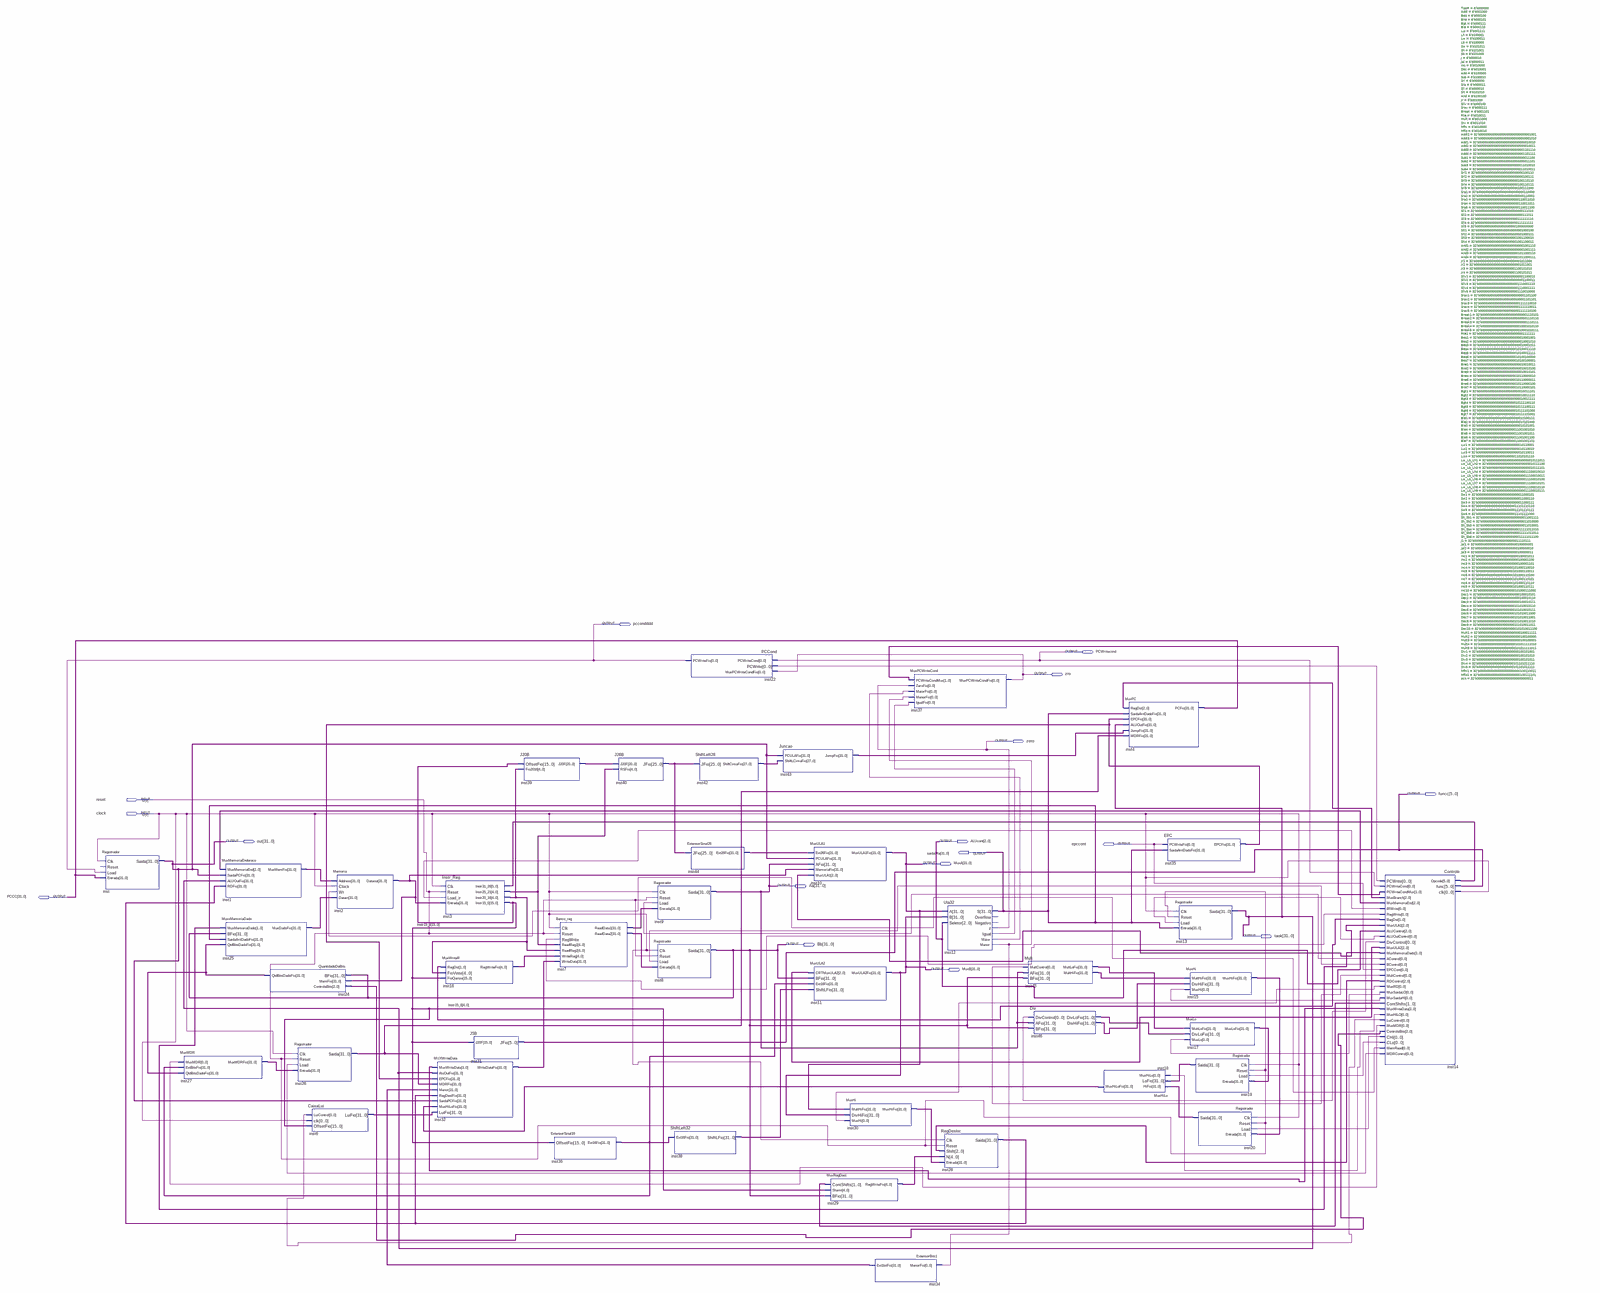
[diagram p0: schematic sheet, whole]
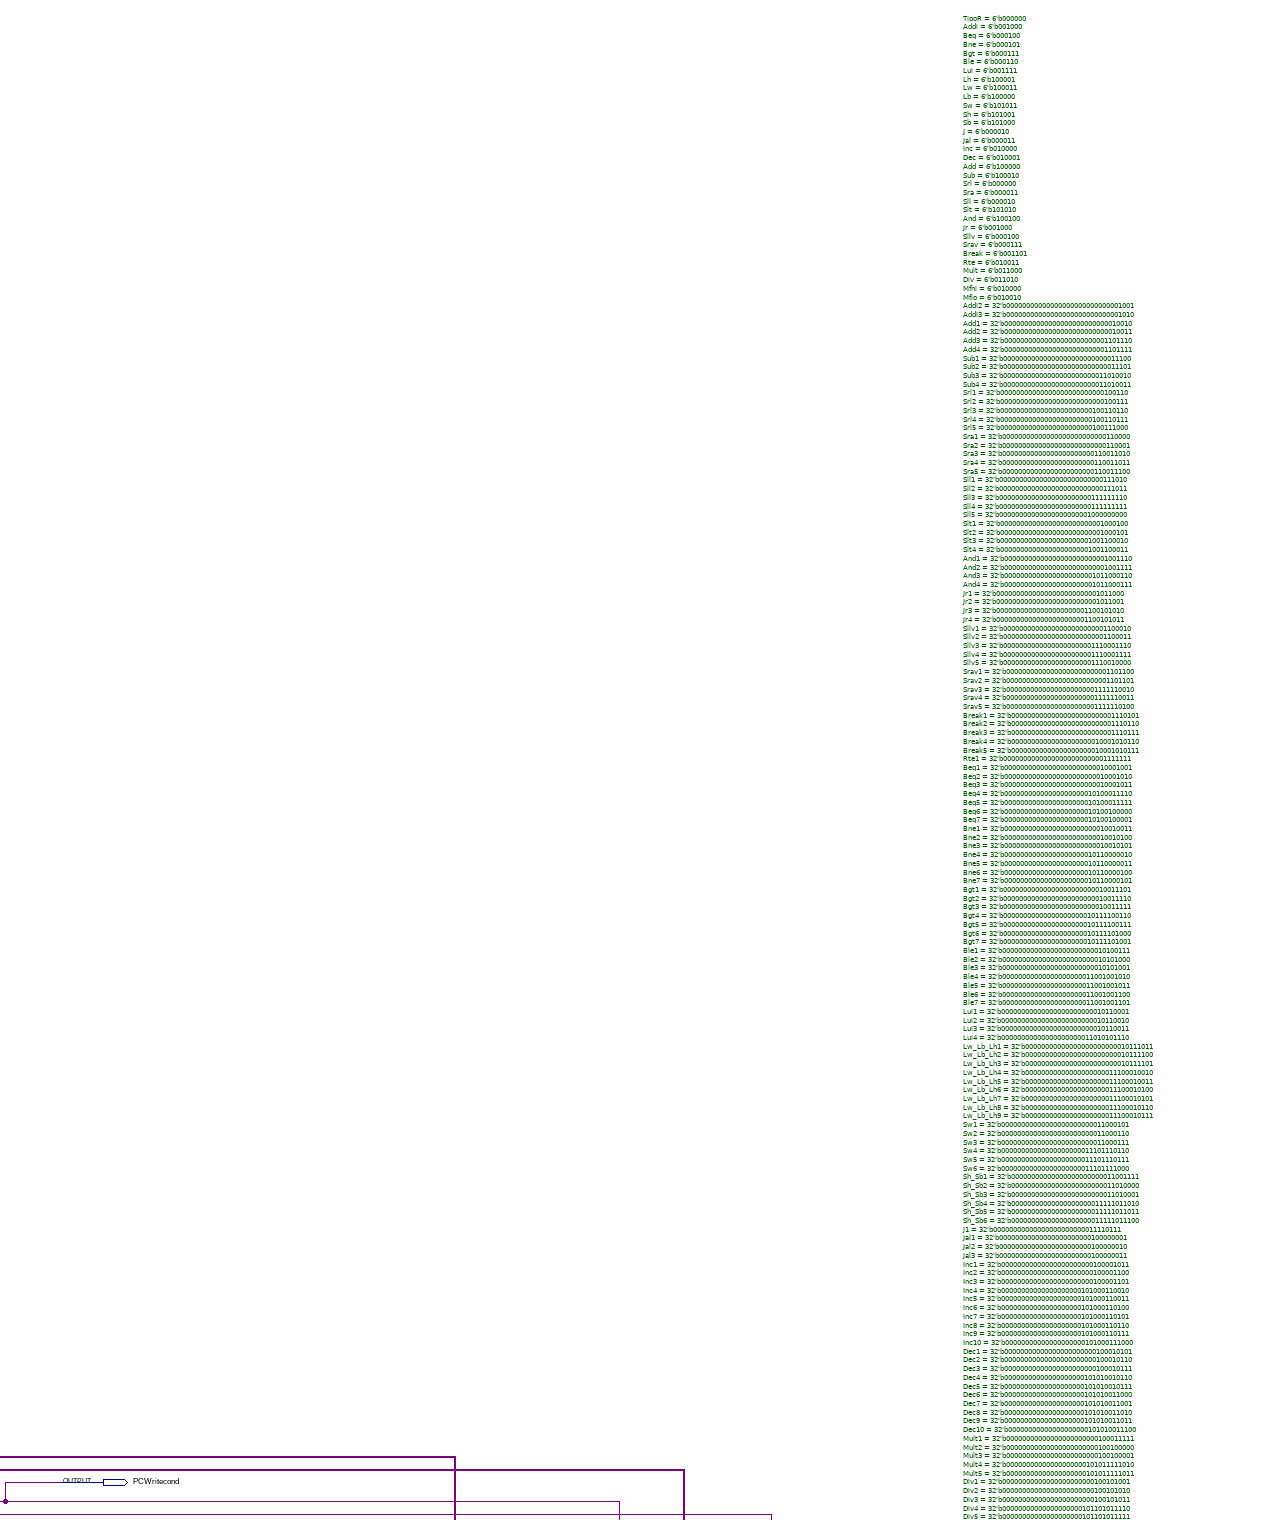
[diagram p1: schematic sheet, upper right part]
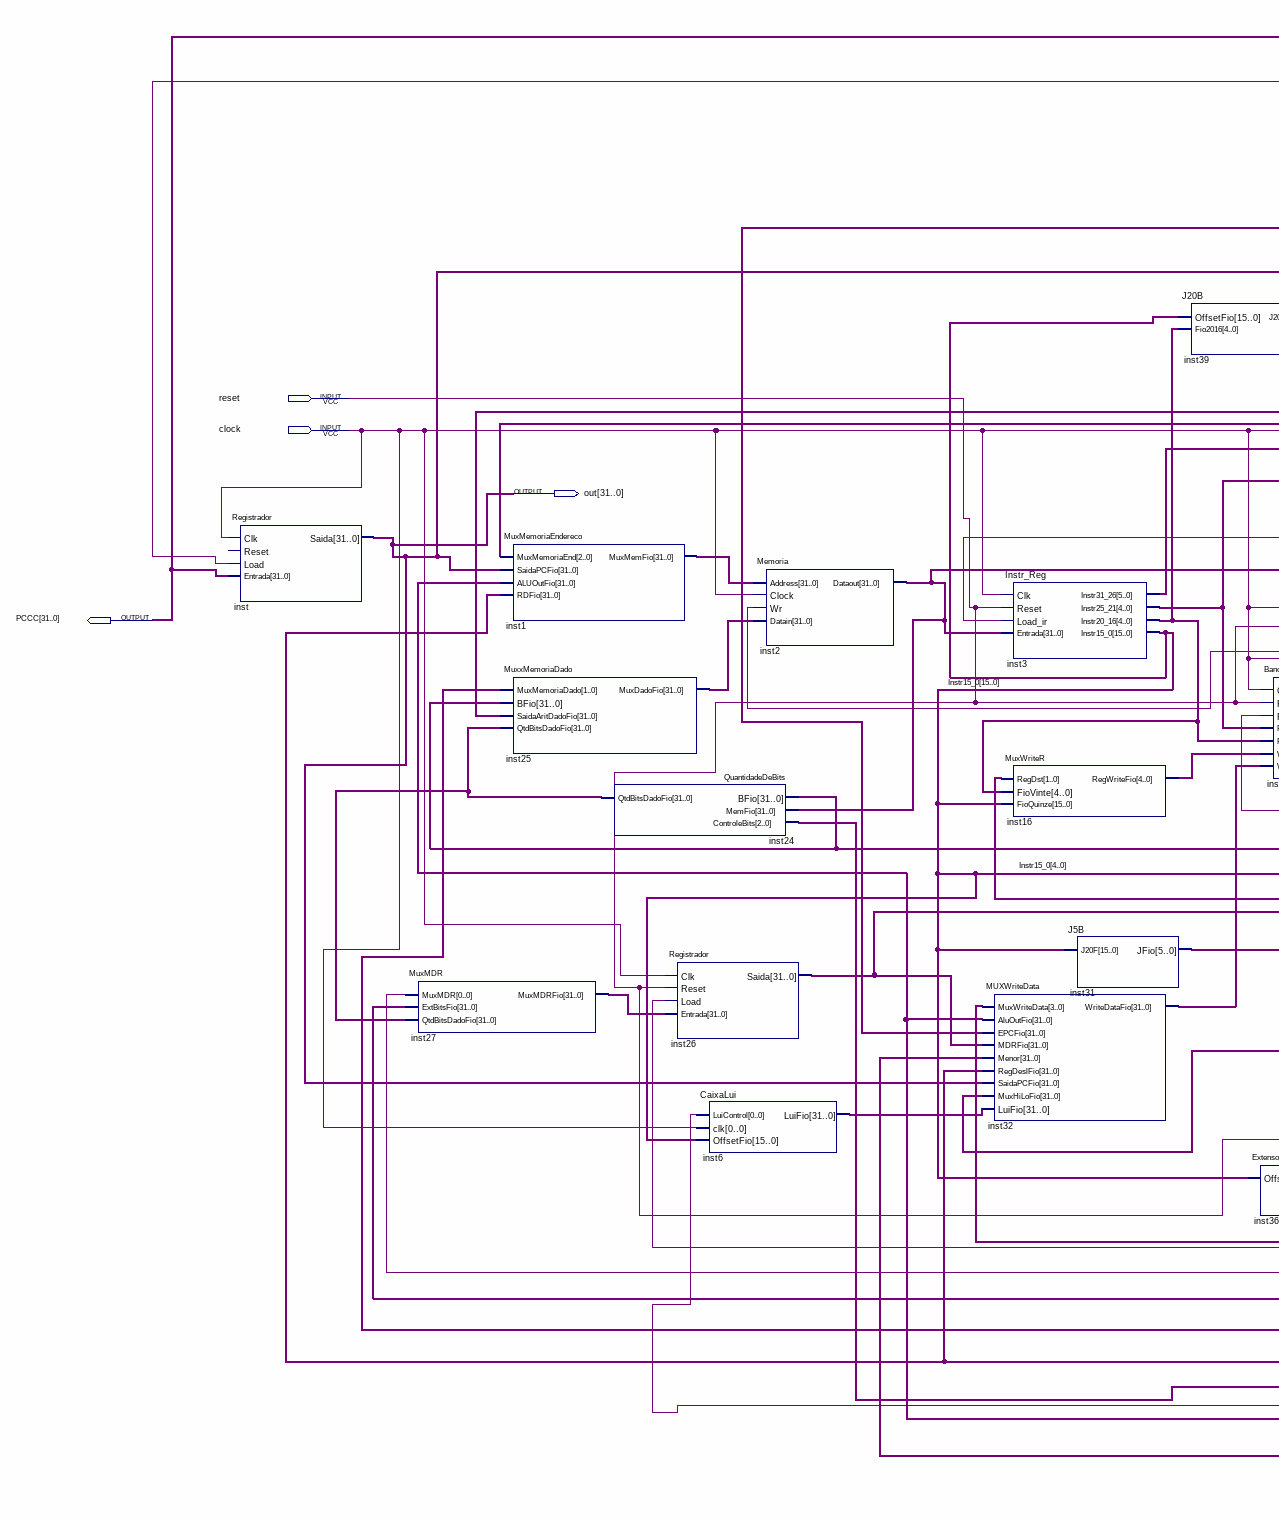
[diagram p2: schematic sheet, lower left part]
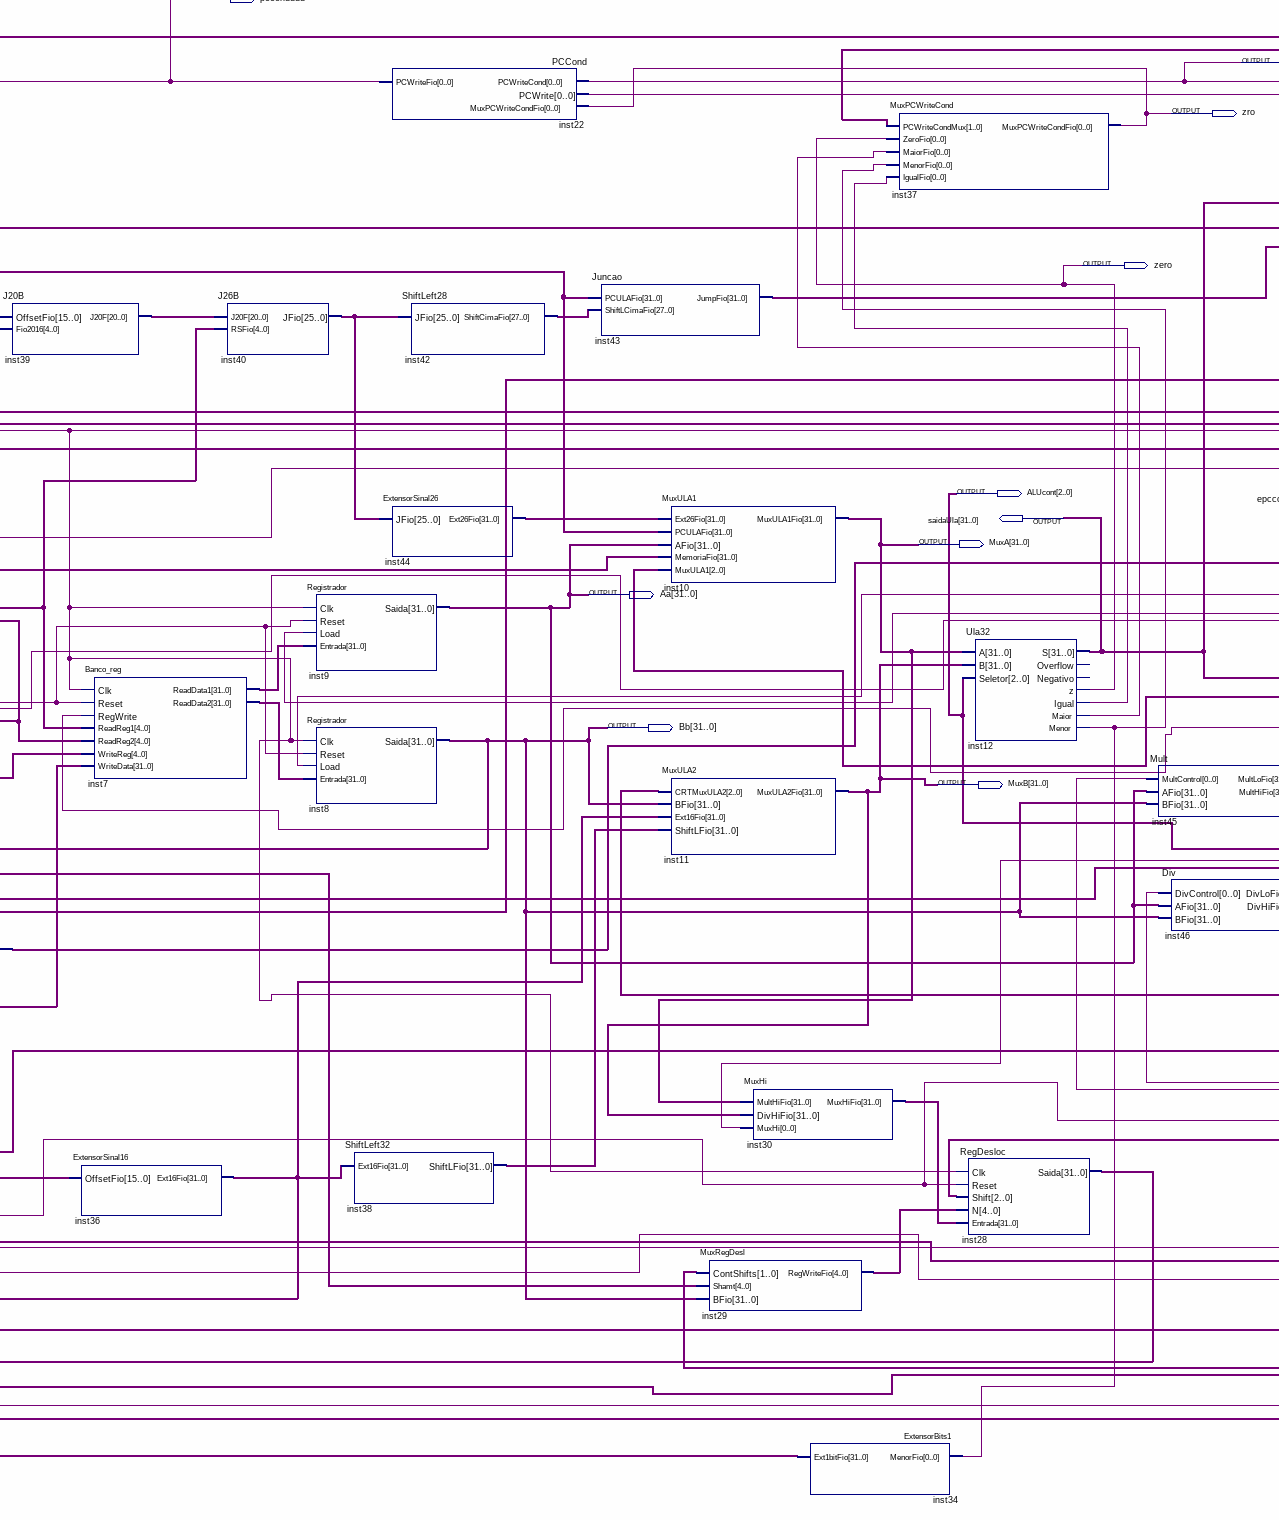
[diagram p3: schematic sheet, lower centre part]
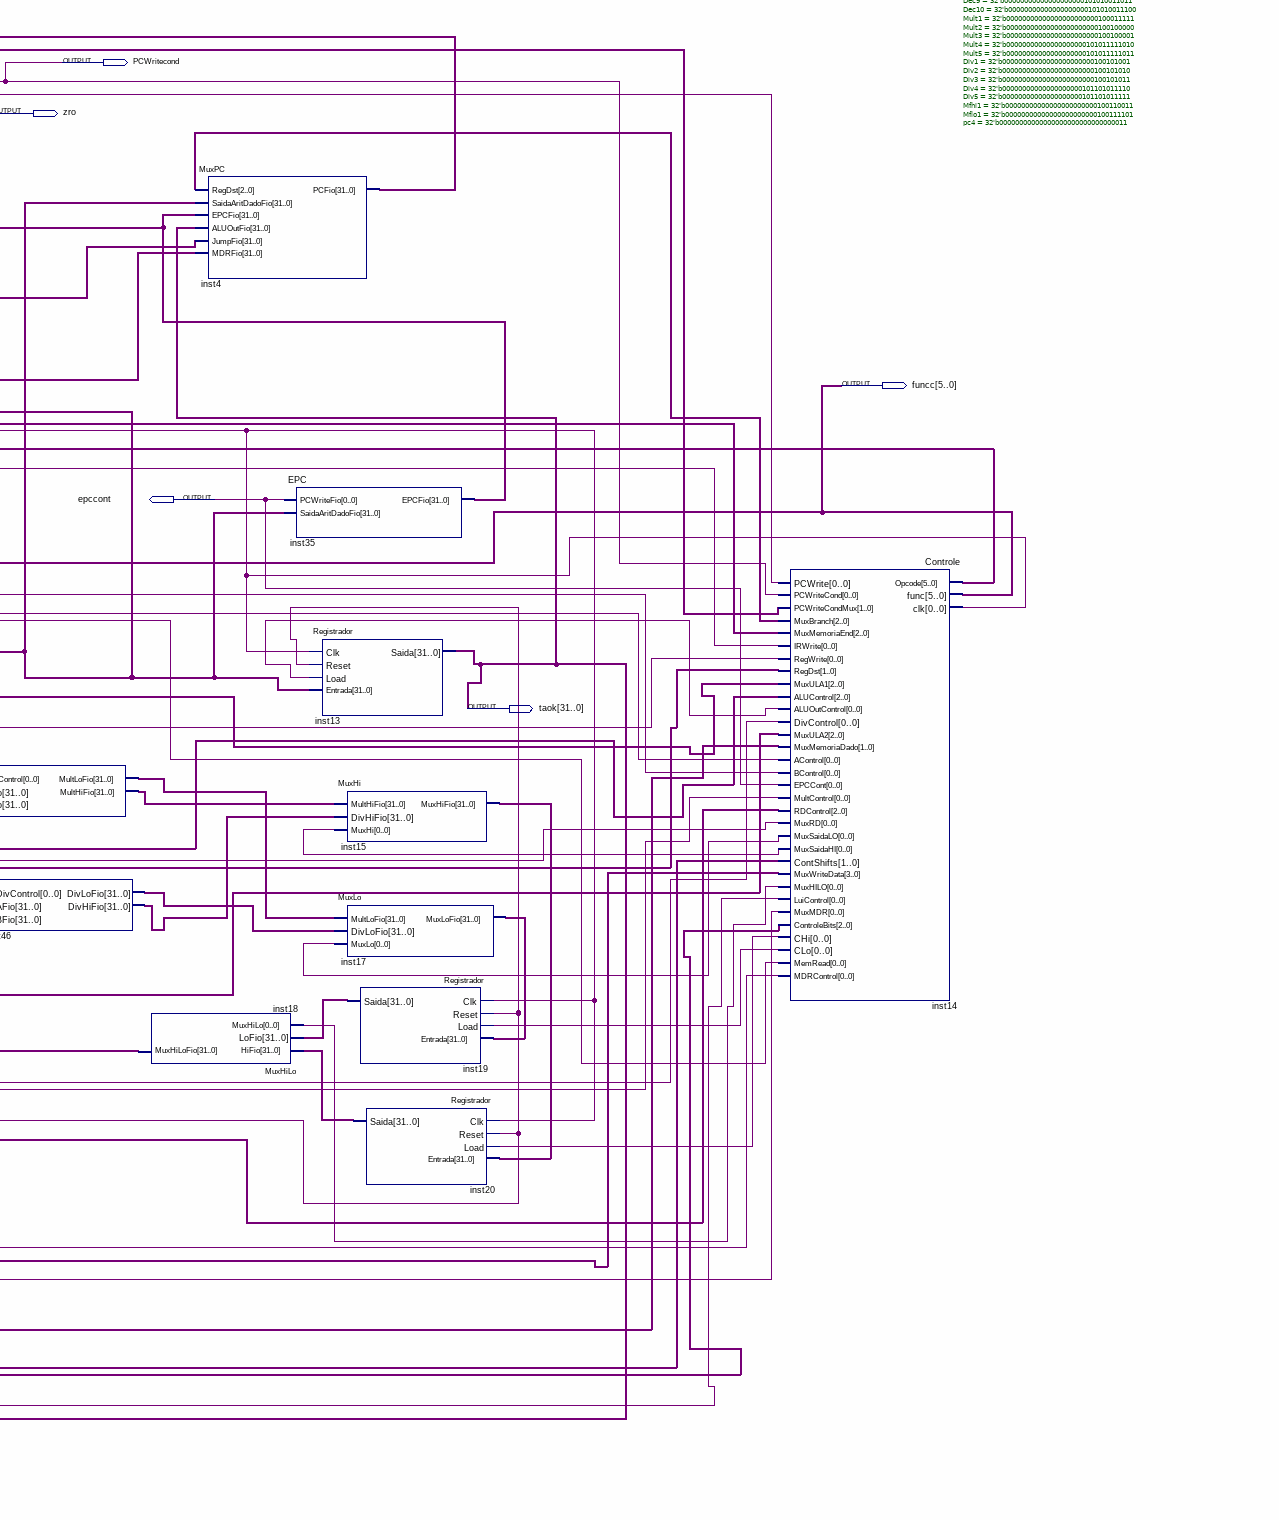
[diagram p4: schematic sheet, lower right part]
// Quartus schematic CPU.bdf as structural Verilog: 42 symbols, 17 pins
module CPU (
  input  reset,
  input  clock,
  output pccondddd,
  output PCWritecond,
  output zro,
  output zero,
  output [5:0] funcc,
  output [31:0] out,
  output [2:0] ALUcont,
  output epccont,
  output [31:0] saidaUla,
  output [31:0] MuxA,
  output [31:0] Aa,
  output [31:0] PCCC,
  output [31:0] taok,
  output [31:0] Bb,
  output [31:0] MuxB
);

  wire inst12_igual, inst12_maior, inst12_menor, inst14_acontrol, inst14_aluoutcontrol, inst14_bcontrol,
       inst14_chi, inst14_clo, inst14_divcontrol, inst14_irwrite, inst14_luicontrol, inst14_mdrcontrol,
       inst14_memread, inst14_multcontrol, inst14_muxhilo, inst14_muxmdr, inst14_muxrd, inst14_muxsaidahi,
       inst14_muxsaidalo, inst14_pcwrite, inst14_regwrite;
  wire [1:0] inst14_contshifts, inst14_muxmemoriadado, inst14_pcwritecondmux, inst14_regdst;
  wire [2:0] inst14_controlebits, inst14_muxbranch, inst14_muxmemoriaend, inst14_muxula1, inst14_muxula2,
       inst14_rdcontrol;
  wire [3:0] inst14_muxwritedata;
  wire [4:0] inst3_instr20_16, inst3_instr25_21, inst16_regwritefio, inst29_regwritefio;
  wire [5:0] inst3_instr31_26;
  wire [15:0] Instr15_0;
  wire [20:0] inst39_j20f;
  wire [25:0] inst40_jfio;
  wire [27:0] inst42_shiftcimafio;
  wire [31:0] inst1_muxmemfio, inst2_dataout, inst6_luifio, inst7_readdata1, inst7_readdata2,
       inst15_muxhifio, inst17_muxlofio, inst18_muxhilofio, inst19_saida, inst20_saida,
       inst24_qtdbitsdadofio, inst25_muxdadofio, inst26_saida, inst27_muxmdrfio, inst28_saida,
       inst30_muxhifio, inst32_writedatafio, inst34_ext1bitfio, inst35_epcfio, inst36_ext16fio,
       inst38_shiftlfio, inst43_jumpfio, inst44_ext26fio, inst45_multhifio, inst45_multlofio,
       inst46_divhifio, inst46_divlofio;

  Registrador inst (.Clk(clock), .Load(pccondddd), .Entrada(PCCC), .Saida(out));  // open: Reset
  MuxMDR inst27 (
    .MuxMDR(inst14_muxmdr), .ExtBitsFio(inst36_ext16fio), .QtdBitsDadoFio(inst24_qtdbitsdadofio),
    .MuxMDRFio(inst27_muxmdrfio));
  MuxMemoriaEndereco inst1 (
    .MuxMemoriaEnd(inst14_muxmemoriaend), .SaidaPCFio(out), .ALUOutFio(taok), .RDFio(inst28_saida),
    .MuxMemFio(inst1_muxmemfio));
  MuxxMemoriaDado inst25 (
    .MuxMemoriaDado(inst14_muxmemoriadado), .BFio(Bb), .SaidaAritDadoFio(saidaUla),
    .QtdBitsDadoFio(inst24_qtdbitsdadofio), .MuxDadoFio(inst25_muxdadofio));
  QuantidadeDeBits inst24 (
    .BFio(Bb), .MemFio(inst2_dataout), .ControleBits(inst14_controlebits),
    .QtdBitsDadoFio(inst24_qtdbitsdadofio));
  Registrador inst26 (
    .Clk(clock), .Reset(reset), .Load(inst14_mdrcontrol), .Entrada(inst27_muxmdrfio), .Saida(inst26_saida));
  CaixaLui inst6 (.LuiControl(inst14_luicontrol), .clk(clock), .OffsetFio(Instr15_0), .LuiFio(inst6_luifio));
  Memoria inst2 (
    .Address(inst1_muxmemfio), .Clock(clock), .Wr(inst14_memread), .Datain(inst25_muxdadofio),
    .Dataout(inst2_dataout));
  Instr_Reg inst3 (
    .Clk(clock), .Reset(reset), .Load_ir(inst14_irwrite), .Entrada(inst2_dataout),
    .Instr31_26(inst3_instr31_26), .Instr25_21(inst3_instr25_21), .Instr20_16(inst3_instr20_16),
    .Instr15_0(Instr15_0));
  MuxWriteR inst16 (
    .RegDst(inst14_regdst), .FioVinte(inst3_instr20_16), .FioQuinze(Instr15_0),
    .RegWriteFio(inst16_regwritefio));
  MUXWriteData inst32 (
    .MuxWriteData(inst14_muxwritedata), .AluOutFio(taok), .EPCFio(inst35_epcfio), .MDRFio(inst26_saida),
    .Menor(inst34_ext1bitfio), .RegDeslFio(inst28_saida), .SaidaPCFio(out), .MuxHiLoFio(inst18_muxhilofio),
    .LuiFio(inst6_luifio), .WriteDataFio(inst32_writedatafio));
  J5B inst31 (.J20F(Instr15_0), .JFio(funcc));
  J20B inst39 (.OffsetFio(Instr15_0), .Fio2016(inst3_instr20_16), .J20F(inst39_j20f));
  ExtensorSinal16 inst36 (.OffsetFio(Instr15_0), .Ext16Fio(inst36_ext16fio));
  Banco_reg inst7 (
    .Clk(clock), .Reset(reset), .RegWrite(inst14_regwrite), .ReadReg1(inst3_instr25_21),
    .ReadReg2(inst3_instr20_16), .WriteReg(inst16_regwritefio), .WriteData(inst32_writedatafio),
    .ReadData1(inst7_readdata1), .ReadData2(inst7_readdata2));
  J26B inst40 (.J20F(inst39_j20f), .RSFio(inst3_instr25_21), .JFio(inst40_jfio));
  Registrador inst9 (.Clk(clock), .Reset(reset), .Load(inst14_acontrol), .Entrada(inst7_readdata1), .Saida(Aa));
  Registrador inst8 (.Clk(clock), .Reset(reset), .Load(inst14_bcontrol), .Entrada(inst7_readdata2), .Saida(Bb));
  PCCond inst22 (.PCWriteCond(PCWritecond), .PCWrite(inst14_pcwrite), .MuxPCWriteCondFio(zro), .PCWriteFio(pccondddd));
  ExtensorSinal26 inst44 (.JFio(inst40_jfio), .Ext26Fio(inst44_ext26fio));
  ShiftLeft32 inst38 (.Ext16Fio(inst36_ext16fio), .ShiftLFio(inst38_shiftlfio));
  ShiftLeft28 inst42 (.JFio(inst40_jfio), .ShiftCimaFio(inst42_shiftcimafio));
  Juncao inst43 (.PCULAFio(out), .ShiftLCimaFio(inst42_shiftcimafio), .JumpFio(inst43_jumpfio));
  MuxULA1 inst10 (
    .Ext26Fio(inst44_ext26fio), .PCULAFio(out), .AFio(Aa), .MemoriaFio(inst2_dataout),
    .MuxULA1(inst14_muxula1), .MuxULA1Fio(MuxA));
  MuxULA2 inst11 (
    .CRTMuxULA2(inst14_muxula2), .BFio(Bb), .Ext16Fio(inst36_ext16fio), .ShiftLFio(inst38_shiftlfio),
    .MuxULA2Fio(MuxB));
  MuxRegDesl inst29 (
    .ContShifts(inst14_contshifts), .Shamt(Instr15_0[4:0]), .BFio(Bb), .RegWriteFio(inst29_regwritefio));
  MuxHi inst30 (.MultHiFio(MuxA), .DivHiFio(MuxB), .MuxHi(inst14_muxrd), .MuxHiFio(inst30_muxhifio));
  ExtensorBits1 inst34 (.MenorFio(inst12_menor), .Ext1bitFio(inst34_ext1bitfio));
  MuxPCWriteCond inst37 (
    .PCWriteCondMux(inst14_pcwritecondmux), .ZeroFio(zero), .MaiorFio(inst12_maior), .MenorFio(inst12_menor),
    .IgualFio(inst12_igual), .MuxPCWriteCondFio(zro));
  Ula32 inst12 (
    .A(MuxA), .B(MuxB), .Seletor(ALUcont), .S(saidaUla), .z(zero), .Igual(inst12_igual),
    .Maior(inst12_maior), .Menor(inst12_menor));  // open: Overflow, Negativo
  RegDesloc inst28 (
    .Clk(clock), .Reset(reset), .Shift(inst14_rdcontrol), .N(inst29_regwritefio), .Entrada(inst30_muxhifio),
    .Saida(inst28_saida));
  Mult inst45 (
    .MultControl(inst14_multcontrol), .AFio(Aa), .BFio(Bb), .MultLoFio(inst45_multlofio),
    .MultHiFio(inst45_multhifio));
  Div inst46 (
    .DivControl(inst14_divcontrol), .AFio(Aa), .BFio(Bb), .DivLoFio(inst46_divlofio),
    .DivHiFio(inst46_divhifio));
  MuxHiLo inst18 (.HiFio(inst20_saida), .LoFio(inst19_saida), .MuxHiLo(inst14_muxhilo), .MuxHiLoFio(inst18_muxhilofio));
  MuxPC inst4 (
    .RegDst(inst14_muxbranch), .SaidaAritDadoFio(saidaUla), .EPCFio(inst35_epcfio), .ALUOutFio(taok),
    .JumpFio(inst43_jumpfio), .MDRFio(inst26_saida), .PCFio(PCCC));
  EPC inst35 (.PCWriteFio(epccont), .SaidaAritDadoFio(saidaUla), .EPCFio(inst35_epcfio));
  Registrador inst13 (.Clk(clock), .Reset(reset), .Load(inst14_aluoutcontrol), .Entrada(saidaUla), .Saida(taok));
  MuxHi inst15 (
    .MultHiFio(inst45_multhifio), .DivHiFio(inst46_divhifio), .MuxHi(inst14_muxsaidahi),
    .MuxHiFio(inst15_muxhifio));
  MuxLo inst17 (
    .MultLoFio(inst45_multlofio), .DivLoFio(inst46_divlofio), .MuxLo(inst14_muxsaidalo),
    .MuxLoFio(inst17_muxlofio));
  Registrador inst19 (.Clk(clock), .Reset(reset), .Load(inst14_clo), .Entrada(inst17_muxlofio), .Saida(inst19_saida));
  Registrador inst20 (.Clk(clock), .Reset(reset), .Load(inst14_chi), .Entrada(inst15_muxhifio), .Saida(inst20_saida));
  Controle #(.TipoR(6'b000000), .Addi(6'b001000), .Beq(6'b000100), .Bne(6'b000101), .Bgt(6'b000111), .Ble(6'b000110), .Lui(6'b001111), .Lh(6'b100001), .Lw(6'b100011), .Lb(6'b100000), .Sw(6'b101011), .Sh(6'b101001), .Sb(6'b101000), .J(6'b000010), .Jal(6'b000011), .Inc(6'b010000), .Dec(6'b010001), .Add(6'b100000), .Sub(6'b100010), .Srl(6'b000000), .Sra(6'b000011), .Sll(6'b000010), .Slt(6'b101010), .And(6'b100100), .Jr(6'b001000), .Sllv(6'b000100), .Srav(6'b000111), .Break(6'b001101), .Rte(6'b010011), .Mult(6'b011000), .Div(6'b011010), .Mfhi(6'b010000), .Mflo(6'b010010), .Addi2(32'b00000000000000000000000000001001), .Addi3(32'b00000000000000000000000000001010), .Add1(32'b00000000000000000000000000010010), .Add2(32'b00000000000000000000000000010011), .Add3(32'b00000000000000000000000001101110), .Add4(32'b00000000000000000000000001101111), .Sub1(32'b00000000000000000000000000011100), .Sub2(32'b00000000000000000000000000011101), .Sub3(32'b00000000000000000000000011010010), .Sub4(32'b00000000000000000000000011010011), .Srl1(32'b00000000000000000000000000100110), .Srl2(32'b00000000000000000000000000100111), .Srl3(32'b00000000000000000000000100110110), .Srl4(32'b00000000000000000000000100110111), .Srl5(32'b00000000000000000000000100111000), .Sra1(32'b00000000000000000000000000110000), .Sra2(32'b00000000000000000000000000110001), .Sra3(32'b00000000000000000000000110011010), .Sra4(32'b00000000000000000000000110011011), .Sra5(32'b00000000000000000000000110011100), .Sll1(32'b00000000000000000000000000111010), .Sll2(32'b00000000000000000000000000111011), .Sll3(32'b00000000000000000000000111111110), .Sll4(32'b00000000000000000000000111111111), .Sll5(32'b00000000000000000000001000000000), .Slt1(32'b00000000000000000000000001000100), .Slt2(32'b00000000000000000000000001000101), .Slt3(32'b00000000000000000000001001100010), .Slt4(32'b00000000000000000000001001100011), .And1(32'b00000000000000000000000001001110), .And2(32'b00000000000000000000000001001111), .And3(32'b00000000000000000000001011000110), .And4(32'b00000000000000000000001011000111), .Jr1(32'b00000000000000000000000001011000), .Jr2(32'b00000000000000000000000001011001), .Jr3(32'b00000000000000000000001100101010), .Jr4(32'b00000000000000000000001100101011), .Sllv1(32'b00000000000000000000000001100010), .Sllv2(32'b00000000000000000000000001100011), .Sllv3(32'b00000000000000000000001110001110), .Sllv4(32'b00000000000000000000001110001111), .Sllv5(32'b00000000000000000000001110010000), .Srav1(32'b00000000000000000000000001101100), .Srav2(32'b00000000000000000000000001101101), .Srav3(32'b00000000000000000000001111110010), .Srav4(32'b00000000000000000000001111110011), .Srav5(32'b00000000000000000000001111110100), .Break1(32'b00000000000000000000000001110101), .Break2(32'b00000000000000000000000001110110), .Break3(32'b00000000000000000000000001110111), .Break4(32'b00000000000000000000010001010110), .Break5(32'b00000000000000000000010001010111), .Rte1(32'b00000000000000000000000001111111), .Beq1(32'b00000000000000000000000010001001), .Beq2(32'b00000000000000000000000010001010), .Beq3(32'b00000000000000000000000010001011), .Beq4(32'b00000000000000000000010100011110), .Beq5(32'b00000000000000000000010100011111), .Beq6(32'b00000000000000000000010100100000), .Beq7(32'b00000000000000000000010100100001), .Bne1(32'b00000000000000000000000010010011), .Bne2(32'b00000000000000000000000010010100), .Bne3(32'b00000000000000000000000010010101), .Bne4(32'b00000000000000000000010110000010), .Bne5(32'b00000000000000000000010110000011), .Bne6(32'b00000000000000000000010110000100), .Bne7(32'b00000000000000000000010110000101), .Bgt1(32'b00000000000000000000000010011101), .Bgt2(32'b00000000000000000000000010011110), .Bgt3(32'b00000000000000000000000010011111), .Bgt4(32'b00000000000000000000010111100110), .Bgt5(32'b00000000000000000000010111100111), .Bgt6(32'b00000000000000000000010111101000), .Bgt7(32'b00000000000000000000010111101001), .Ble1(32'b00000000000000000000000010100111), .Ble2(32'b00000000000000000000000010101000), .Ble3(32'b00000000000000000000000010101001), .Ble4(32'b00000000000000000000011001001010), .Ble5(32'b00000000000000000000011001001011), .Ble6(32'b00000000000000000000011001001100), .Ble7(32'b00000000000000000000011001001101), .Lui1(32'b00000000000000000000000010110001), .Lui2(32'b00000000000000000000000010110010), .Lui3(32'b00000000000000000000000010110011), .Lui4(32'b00000000000000000000011010101110), .Lw_Lb_Lh1(32'b00000000000000000000000010111011), .Lw_Lb_Lh2(32'b00000000000000000000000010111100), .Lw_Lb_Lh3(32'b00000000000000000000000010111101), .Lw_Lb_Lh4(32'b00000000000000000000011100010010), .Lw_Lb_Lh5(32'b00000000000000000000011100010011), .Lw_Lb_Lh6(32'b00000000000000000000011100010100), .Lw_Lb_Lh7(32'b00000000000000000000011100010101), .Lw_Lb_Lh8(32'b00000000000000000000011100010110), .Lw_Lb_Lh9(32'b00000000000000000000011100010111), .Sw1(32'b00000000000000000000000011000101), .Sw2(32'b00000000000000000000000011000110), .Sw3(32'b00000000000000000000000011000111), .Sw4(32'b00000000000000000000011101110110), .Sw5(32'b00000000000000000000011101110111), .Sw6(32'b00000000000000000000011101111000), .Sh_Sb1(32'b00000000000000000000000011001111), .Sh_Sb2(32'b00000000000000000000000011010000), .Sh_Sb3(32'b00000000000000000000000011010001), .Sh_Sb4(32'b00000000000000000000011111011010), .Sh_Sb5(32'b00000000000000000000011111011011), .Sh_Sb6(32'b00000000000000000000011111011100), .J1(32'b00000000000000000000000011110111), .Jal1(32'b00000000000000000000000100000001), .Jal2(32'b00000000000000000000000100000010), .Jal3(32'b00000000000000000000000100000011), .Inc1(32'b00000000000000000000000100001011), .Inc2(32'b00000000000000000000000100001100), .Inc3(32'b00000000000000000000000100001101), .Inc4(32'b00000000000000000000101000110010), .Inc5(32'b00000000000000000000101000110011), .Inc6(32'b00000000000000000000101000110100), .Inc7(32'b00000000000000000000101000110101), .Inc8(32'b00000000000000000000101000110110), .Inc9(32'b00000000000000000000101000110111), .Inc10(32'b00000000000000000000101000111000), .Dec1(32'b00000000000000000000000100010101), .Dec2(32'b00000000000000000000000100010110), .Dec3(32'b00000000000000000000000100010111), .Dec4(32'b00000000000000000000101010010110), .Dec5(32'b00000000000000000000101010010111), .Dec6(32'b00000000000000000000101010011000), .Dec7(32'b00000000000000000000101010011001), .Dec8(32'b00000000000000000000101010011010), .Dec9(32'b00000000000000000000101010011011), .Dec10(32'b00000000000000000000101010011100), .Mult1(32'b00000000000000000000000100011111), .Mult2(32'b00000000000000000000000100100000), .Mult3(32'b00000000000000000000000100100001), .Mult4(32'b00000000000000000000101011111010), .Mult5(32'b00000000000000000000101011111011), .Div1(32'b00000000000000000000000100101001), .Div2(32'b00000000000000000000000100101010), .Div3(32'b00000000000000000000000100101011), .Div4(32'b00000000000000000000101101011110), .Div5(32'b00000000000000000000101101011111), .Mfhi1(32'b00000000000000000000000100110011), .Mflo1(32'b00000000000000000000000100111101), .pc4(32'b00000000000000000000000000000011)) inst14 (
    .Opcode(inst3_instr31_26), .func(funcc), .clk(clock), .PCWrite(inst14_pcwrite),
    .PCWriteCond(PCWritecond), .PCWriteCondMux(inst14_pcwritecondmux), .MuxBranch(inst14_muxbranch),
    .MuxMemoriaEnd(inst14_muxmemoriaend), .IRWrite(inst14_irwrite), .RegWrite(inst14_regwrite),
    .RegDst(inst14_regdst), .MuxULA1(inst14_muxula1), .ALUControl(ALUcont),
    .ALUOutControl(inst14_aluoutcontrol), .DivControl(inst14_divcontrol), .MuxULA2(inst14_muxula2),
    .MuxMemoriaDado(inst14_muxmemoriadado), .AControl(inst14_acontrol), .BControl(inst14_bcontrol),
    .EPCCont(epccont), .MultControl(inst14_multcontrol), .RDControl(inst14_rdcontrol), .MuxRD(inst14_muxrd),
    .MuxSaidaLO(inst14_muxsaidalo), .MuxSaidaHI(inst14_muxsaidahi), .ContShifts(inst14_contshifts),
    .MuxWriteData(inst14_muxwritedata), .MuxHILO(inst14_muxhilo), .LuiControl(inst14_luicontrol),
    .MuxMDR(inst14_muxmdr), .ControleBits(inst14_controlebits), .CHi(inst14_chi), .CLo(inst14_clo),
    .MemRead(inst14_memread), .MDRControl(inst14_mdrcontrol));
endmodule
